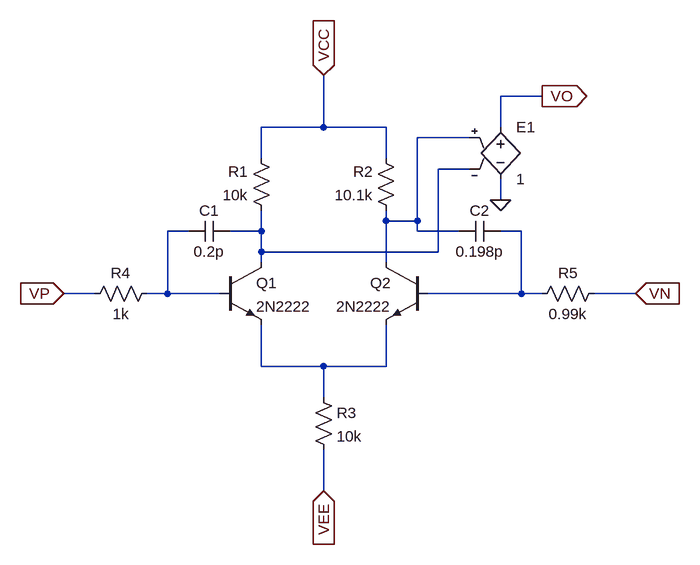
[diagram p0: schematic fig-02-03-33-sub.asc]
fig-02-03-33-sub.asc, the LTspice schematic file:
Version 4
SHEET 1 1040 692
WIRE -64 -256 -128 -256
WIRE -400 -208 -400 -288
WIRE -400 -208 -496 -208
WIRE -304 -208 -400 -208
WIRE -128 -208 -128 -256
WIRE -176 -192 -256 -192
WIRE -496 -160 -496 -208
WIRE -304 -160 -304 -208
WIRE -176 -144 -224 -144
WIRE -128 -96 -128 -128
WIRE -304 -64 -304 -80
WIRE -256 -64 -256 -192
WIRE -256 -64 -304 -64
WIRE -608 -48 -640 -48
WIRE -496 -48 -496 -80
WIRE -496 -48 -544 -48
WIRE -256 -48 -256 -64
WIRE -192 -48 -256 -48
WIRE -96 -48 -128 -48
WIRE -496 -16 -496 -48
WIRE -224 -16 -224 -144
WIRE -224 -16 -496 -16
WIRE -496 0 -496 -16
WIRE -304 0 -304 -64
WIRE -752 48 -800 48
WIRE -640 48 -640 -48
WIRE -640 48 -672 48
WIRE -560 48 -640 48
WIRE -96 48 -96 -48
WIRE -96 48 -240 48
WIRE -64 48 -96 48
WIRE 80 48 16 48
WIRE -496 160 -496 96
WIRE -400 160 -496 160
WIRE -304 160 -304 96
WIRE -304 160 -400 160
WIRE -400 208 -400 160
WIRE -400 352 -400 288
FLAG -64 -256 VO
IOPIN -64 -256 Out
FLAG -400 352 VEE
IOPIN -400 352 In
FLAG -400 -288 VCC
IOPIN -400 -288 In
FLAG -800 48 VP
IOPIN -800 48 In
FLAG 80 48 VN
IOPIN 80 48 In
FLAG -128 -96 0
SYMBOL res -480 -64 R180
WINDOW 0 36 76 Left 2
WINDOW 3 36 40 Left 2
SYMATTR InstName R1
SYMATTR Value 10k
SYMBOL npn -560 0 R0
SYMATTR InstName Q1
SYMATTR Value 2N2222
SYMBOL npn -240 0 M0
SYMATTR InstName Q2
SYMATTR Value 2N2222
SYMBOL res -288 -64 R180
WINDOW 0 36 76 Left 2
WINDOW 3 36 40 Left 2
SYMATTR InstName R2
SYMATTR Value 10.1k
SYMBOL res -416 192 R0
SYMATTR InstName R3
SYMATTR Value 10k
SYMBOL e -128 -224 R0
SYMATTR InstName E1
SYMATTR Value 1
SYMBOL cap -544 -64 R90
WINDOW 0 0 32 VBottom 2
WINDOW 3 32 32 VTop 2
SYMATTR InstName C1
SYMATTR Value 0.2p
SYMBOL cap -128 -64 R90
WINDOW 0 0 32 VBottom 2
WINDOW 3 32 32 VTop 2
SYMATTR InstName C2
SYMATTR Value 0.198p
SYMBOL res -656 32 R90
WINDOW 0 0 56 VBottom 2
WINDOW 3 32 56 VTop 2
SYMATTR InstName R4
SYMATTR Value 1k
SYMBOL res 32 32 R90
WINDOW 0 0 56 VBottom 2
WINDOW 3 32 56 VTop 2
SYMATTR InstName R5
SYMATTR Value 0.99k

The netlist it stands for:
* fig-02-03-33-sub.asc
R1 N002 VCC 10k
Q1 N002 N003 N005 0 2N2222
Q2 N001 N004 N005 0 2N2222
R2 N001 VCC 10.1k
R3 N005 VEE 10k
E1 VO 0 N001 N002 1
C1 N002 N003 0.2p
C2 N004 N001 0.198p
R4 N003 VP 1k
R5 VN N004 0.99k
.model NPN NPN
.model PNP PNP
.lib standard.bjt
.backanno
.end